# EAGLE design Xbee circuit (EAGLE 6.4)
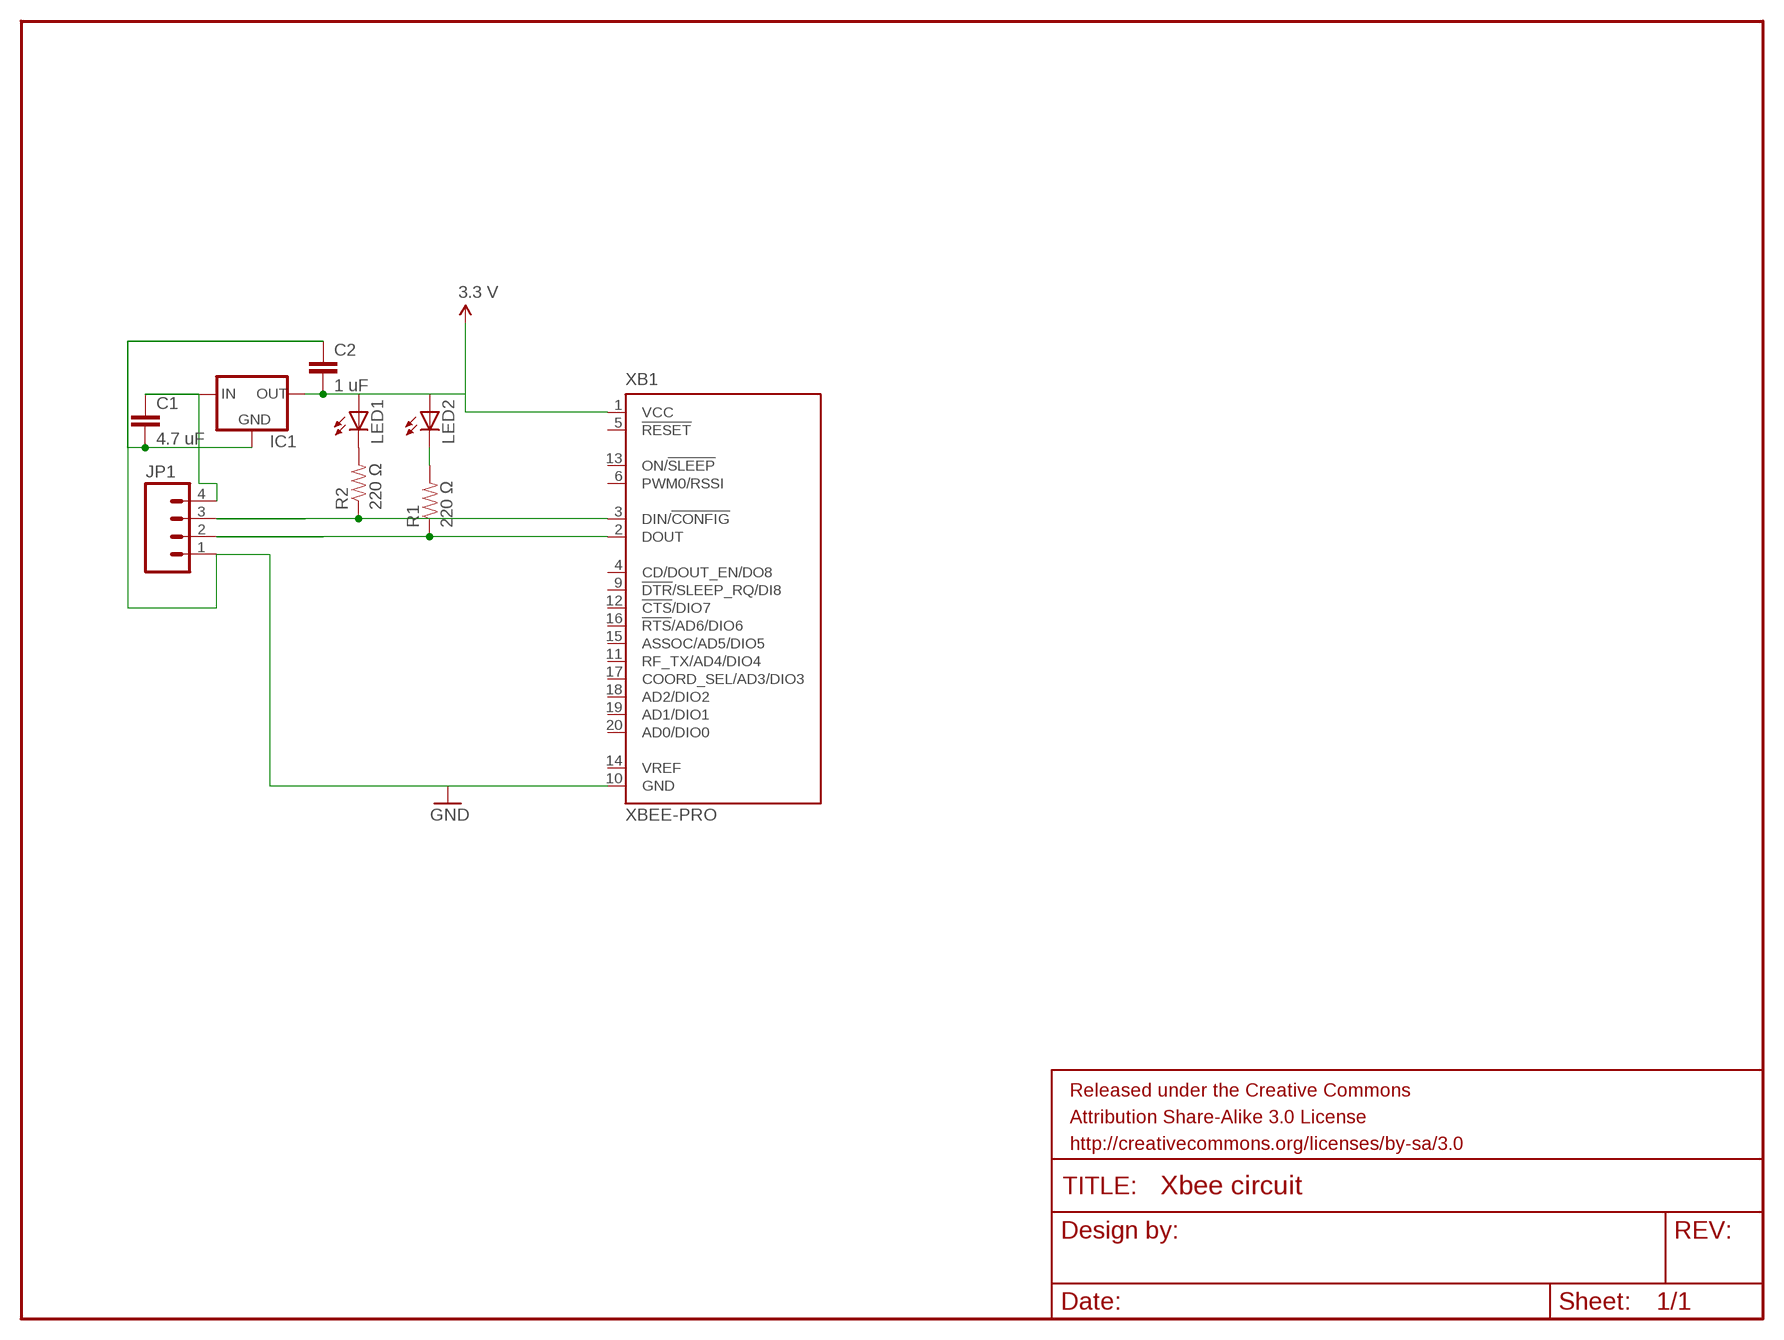
[diagram p0: schematic, sheet 1]

## Parts
C1  4.7 uF  CAP0805  [0805]
C2  1 uF  CAP0805  [0805]
FRAME1  FRAME-LETTER  [CREATIVE_COMMONS]
IC1  V_REG_78XXSINK  [TO220-IGO]
JP1  M04LOCK  [1X04_LOCK]
LED1  LED5MM  [LED5MM]
LED2  LED5MM  [LED5MM]
R1  220 Ω  RESISTOR0805-RES  [0805]
R2  220 Ω  RESISTOR0805-RES  [0805]
XB1  XBEE-PRO  [XBEE-PRO]

## Nets
GND: C1.2 C2.1 IC1.GND JP1.1 XB1.10(GND)
N$1: LED2.K(C) R1.2
N$2: LED1.K(C) R2.2
N$3: JP1.3 R2.1 XB1.3(DIN/!CONFIG)
N$4: JP1.2 R1.1 XB1.2(DOUT)
N$5: C1.1 IC1.IN JP1.4
VCC: C2.2 IC1.OUT LED1.A LED2.A XB1.1(VCC) ; supply symbol labelled 3.3 V
Unconnected: XB1.4(CD/DOUT_EN/DO8) XB1.5(!RESET) XB1.6(PWM0/RSSI) XB1.9(!DTR!/SLEEP_RQ/DI8) XB1.11(RF_TX/AD4/DIO4) XB1.12(!CTS!/DIO7) XB1.13(ON/!SLEEP) XB1.14(VREF) XB1.15(ASSOC/AD5/DIO5) XB1.16(!RTS!/AD6/DIO6) XB1.17(COORD_SEL/AD3/DIO3) XB1.18(AD2/DIO2) XB1.19(AD1/DIO1) XB1.20(AD0/DIO0)

## Library data of the parts
C1 C2 = SparkFun-Capacitors:CAP: Capacitor Standard 0603 ceramic capacitor, and 0.1" leaded capacitor.
FRAME1 = SparkFun-Aesthetics:FRAME-LETTER: Schematic Frame Standard 8.5x11 US Letter frame
IC1 = SparkFun-PowerIC:V_REG_78XX: Voltage Regulator Standard 7805 5V regulator. IGO (Input Ground Output). Spark Fun Electronics SKU : COM-00107
JP1 = SparkFun-Connectors:M04: Header 4 Standard 4-pin 0.1" header. Use with straight break away headers (SKU : PRT-00116), right angle break away headers (PRT-00553), swiss pins (PRT-00743), machine pins (PRT-00117), and female headers (PRT-00115). Molex polarized connector foot print use with SKU : PRT-08231 with associated crimp pins and housings. 1MM SMD Version SKU: PRT-10208
LED1 LED2 = SparkFun-LED:LED: LEDs Standard schematic elements and footprints for 5mm, 3mm, 1206, and 0603 sized LEDs. 5mm - Spark Fun Electronics SKU : COM-00529 (and others)
R1 R2 = SparkFun-Resistors:RESISTOR: Resistor Basic schematic elements and footprints for 0603, 1206, and PTH resistors.
XB1 = maxstream:XBEE: XBee (TM) /XBee-PRO(TM) OEM RF Modules Source: MaxStream, Inc. xbee_productmanual.pdf; MPN: XBP24-AWI-001; OC_FARNELL: 1337916; OC_NEWARK: 42M2667

## Board
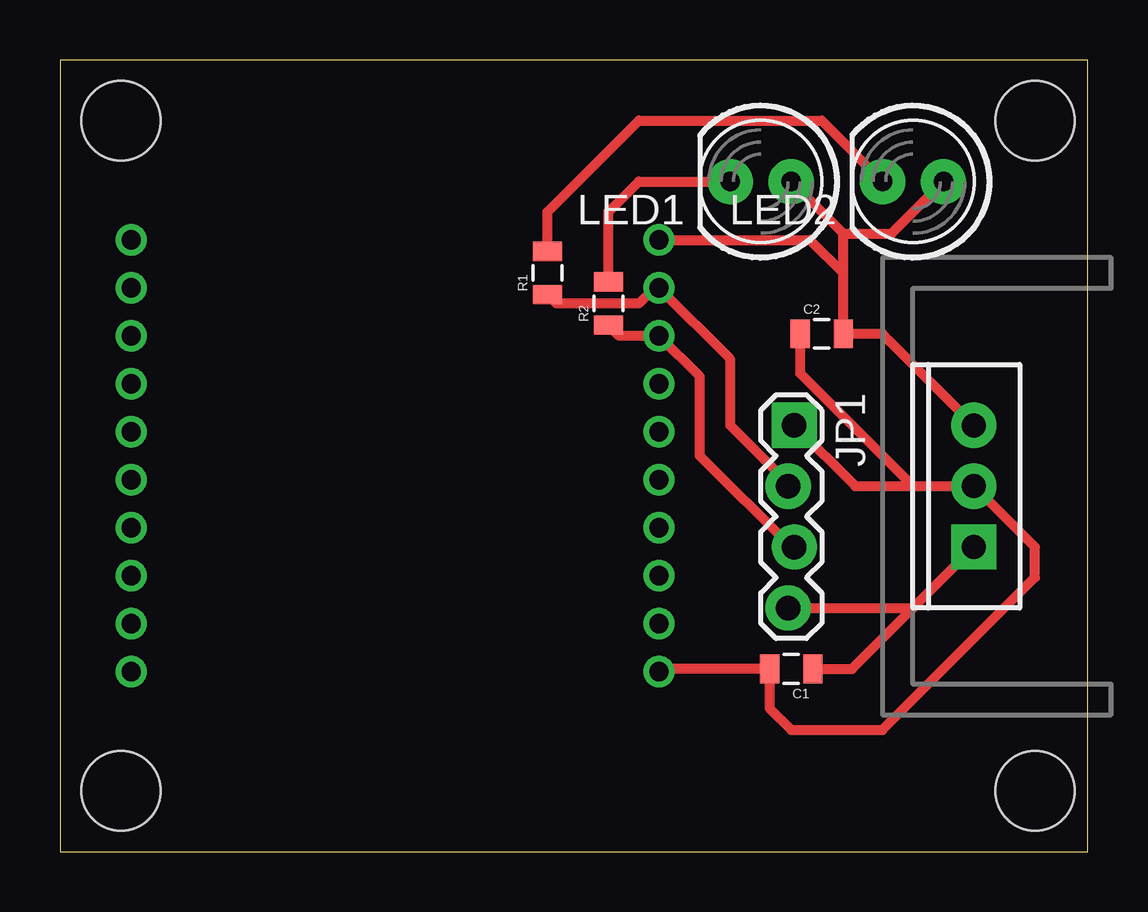
[diagram p1: board, top side]
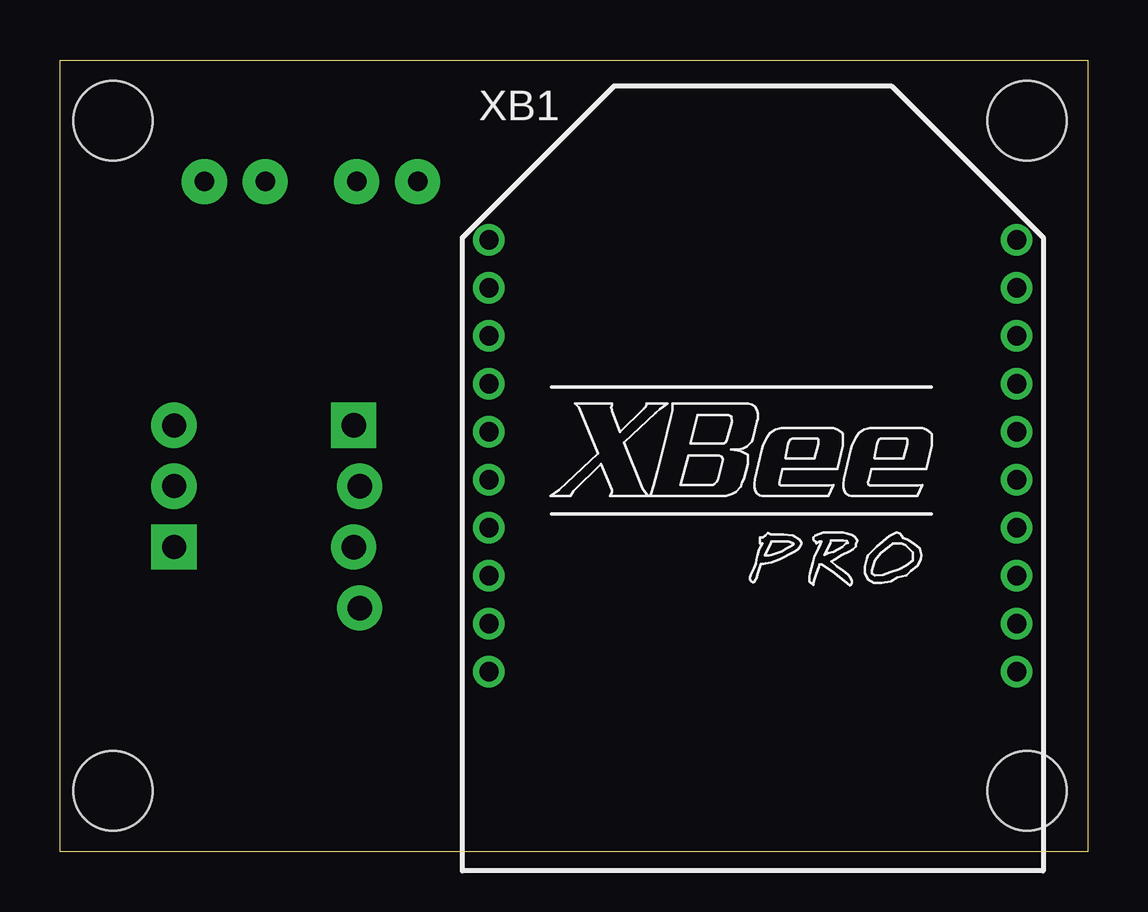
[diagram p2: board, bottom side, seen from below]

Size 42.85 x 33.01 mm. Coordinates in mm from the lower left corner, seen from the top.
Outline: 0,0 42.85,0 42.85,33.01 0,33.01 0,0
Copper layers (1*16): Top 0.035mm / dielectric 1.5mm / Bottom 0.035mm
Design rules "default": minimum track width 10mil, minimum drill 24mil, track to track 8mil, track to pad 8mil, pad to pad 8mil, via to via 8mil, smd to smd 8mil, copper to edge 40mil, drill to drill 8mil, minimum pad ring 10mil, minimum via ring 8mil, stop-mask expansion 4mil, vias tented up to drill 0mil, thermal gap 10mil

### Footprints (pad centres in the part's own frame; a part is rotated, then mirrored left to right if it is on the bottom)
0805 = smd 0.8 x 1.2: 1 -0.9,0; 2 0.9,0
TO220-IGO = drill 1 pad 1.88: GND 0,0; OUT 2.54,0 | drill 1 pad 1.88 square: IN -2.54,0
1X04_LOCK = drill 1.016 pad 1.88 square: 1 0,0.127 | drill 1.016 pad 1.88: 2 2.54,-0.127; 3 5.08,0.127; 4 7.62,-0.127
LED5MM = drill 0.813 pad 1.88: A -1.27,0; K 1.27,0
STAND-OFF = hole 3.302: 0,0
XBEE-PRO = drill 0.8 pad 1.27: 1 -11,9; 2 -11,7; 3 -11,5; 4 -11,3; 5 -11,1; 6 -11,-1; 7 -11,-3; 8 -11,-5; 9 -11,-7; 10 -11,-9; 11 11,-9; 12 11,-7; 13 11,-5; 14 11,-3; 15 11,-1; 16 11,1; 17 11,3; 18 11,5; 19 11,7; 20 11,9

### Placement (x,y rotation side)
C1  30.48,7.62 180 top
C2  31.75,21.59 0 top
FRAME1  3.81,-16.51 0 top  (outside the outline)
IC1  38.1,15.24 90 top
JP1  30.48,17.78 270 top
LED1  29.21,27.94 180 top
LED2  35.56,27.94 180 top
R1  20.32,24.13 90 top
R2  22.86,22.86 90 top
U$1  [STAND-OFF]  2.54,30.48 0 top
U$2  [STAND-OFF]  2.54,2.54 0 top
U$3  [STAND-OFF]  40.64,2.54 0 top
U$4  [STAND-OFF]  40.64,30.48 0 top
XB1  13.97,16.51 0 bottom

### Tracks (layer width: path | path; a pad name or v marks a point on that pad's centre or on a via)
GND
  Top 0.406: 37.2,15.24 IC1.GND | JP1.1 33.15,15.24 35.56,15.24 | 35.56,15.24 IC1.GND | XB1.10 25.08,7.62 C1.2 29.58,5.98 30.48,5.08 34.29,5.08 40.64,11.43 40.64,12.7 IC1.GND | C2.1 30.85,19.95 35.56,15.24
N$1
  Top 0.406: R1.2 20.32,26.67 24.13,30.48 31.75,30.48 LED2.K
N$2
  Top 0.406: R2.2 22.86,26.67 24.13,27.94 LED1.K
N$3
  Top 0.406: R2.1 23.31,21.51 XB1.3 26.67,19.81 26.67,16.51 30.48,12.7 JP1.3
N$4
  Top 0.406: R1.1 20.69,22.86 24.13,22.86 24.78,23.51 XB1.2 27.94,20.54 27.94,17.78 30.35,15.37 JP1.2
N$5
  Top 0.406: C1.1 33.02,7.62 IC1.IN 35.56,10.16 JP1.4
VCC
  Top 0.406: 32.65,24.13 C2.2 34.29,21.59 IC1.OUT | 32.65,24.13 32.65,25.77 | 32.65,25.77 LED1.A | 32.65,25.77 34.66,25.77 LED2.A | XB1.1 31.27,25.51 32.65,24.13